# Altium schematic sheet SoftCore_SA_P3.SchDoc: =ProjectTitle
size B; Engineer: Hab S Collector; Address1: 3621 Gin Way; Address2: Snellville GA, 30039; SheetNumber: 3; SheetTotal: 7
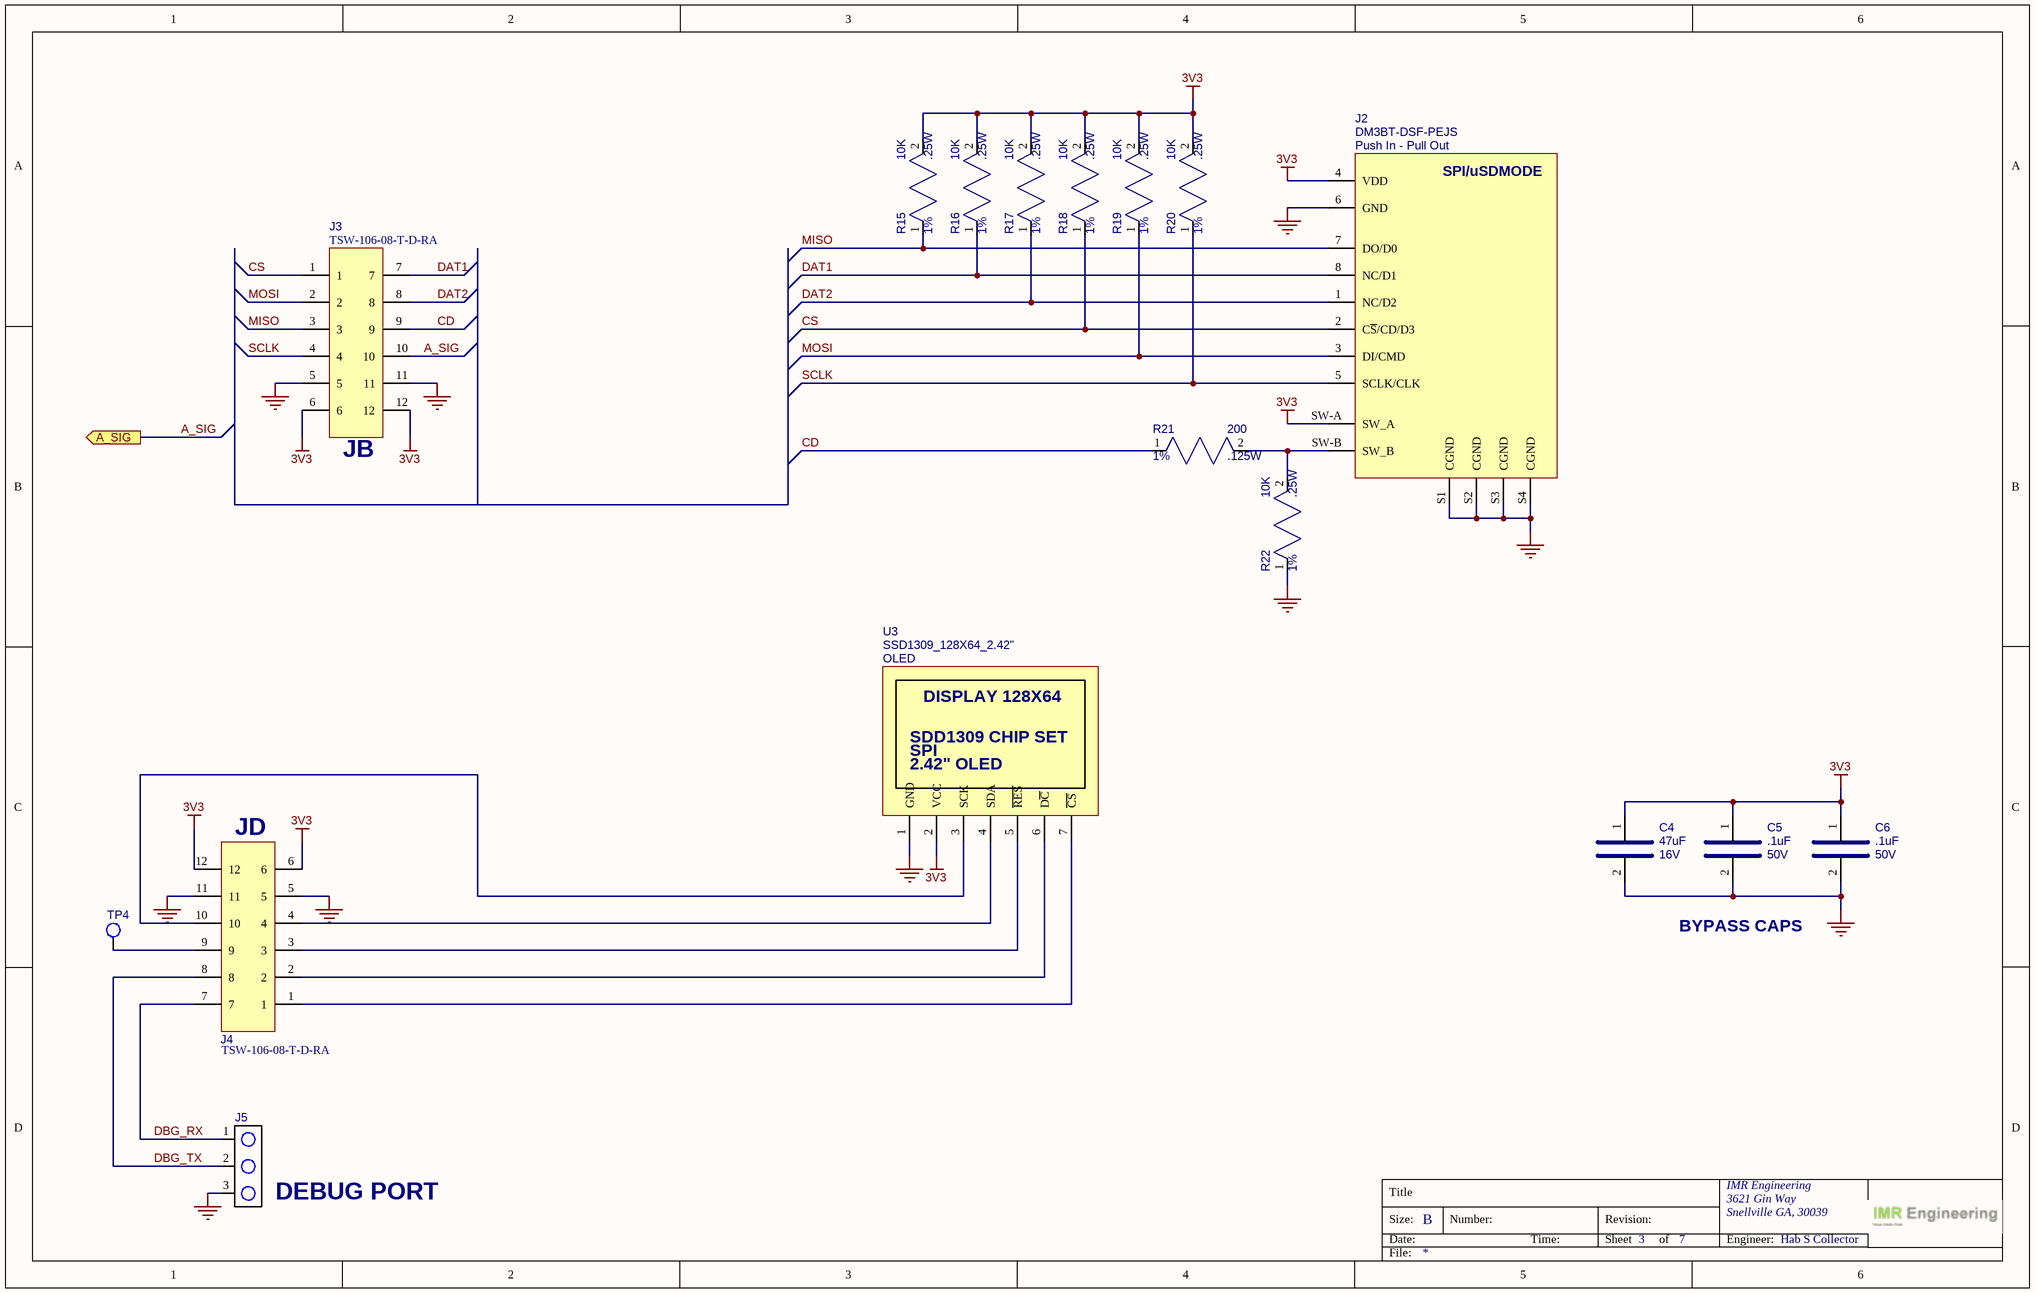
[diagram p0: SoftCore_SA_P3.SchDoc]

## Parts
C4  value 47uF  Voltage: 16V  [CAP_1210]  (hidden comment: GRM32ER60J476ME20L)
C5  value .1uF  Voltage: 50V  [CAP_0805]  (hidden comment: KGM21NR71H104KT)
C6  value .1uF  Voltage: 50V  [CAP_0805]  (hidden comment: KGM21NR71H104KT)
J2  value Push In - Pull Out  [HRS_DM3BT-DSF-PEJS]  (hidden comment: DM3BT-DSF-PEJS)
J3  TSW-106-08-T-D-RA  [SAMTEC_TSW-106-08-T-D-RA]
J4  TSW-106-08-T-D-RA  [SAMTEC_TSW-106-08-T-D-RA]
J5  PREC003SFAN-RC  [HDR_1X3_100MILL]  (value not drawn)
R15  value 10K  Power: .25W  Tolerance: 1%  [RES_0805]  (hidden comment: RC0805FR-7W10KL)
R16  value 10K  Power: .25W  Tolerance: 1%  [RES_0805]  (hidden comment: RC0805FR-7W10KL)
R17  value 10K  Power: .25W  Tolerance: 1%  [RES_0805]  (hidden comment: RC0805FR-7W10KL)
R18  value 10K  Power: .25W  Tolerance: 1%  [RES_0805]  (hidden comment: RC0805FR-7W10KL)
R19  value 10K  Power: .25W  Tolerance: 1%  [RES_0805]  (hidden comment: RC0805FR-7W10KL)
R20  value 10K  Power: .25W  Tolerance: 1%  [RES_0805]  (hidden comment: RC0805FR-7W10KL)
R21  value 200  Power: .125W  Tolerance: 1%  [RES_0805]  (hidden comment: RC0805FR-07200RL)
R22  value 10K  Power: .25W  Tolerance: 1%  [RES_0805]  (hidden comment: RC0805FR-7W10KL)
TP4  (no value)  [TEST_POINT_20MIL_TH]  (no BOM)
U3  TYPE: OLED  [MODULE_DISPLAY_128X64_2.42]  (hidden comment: SSD1309_128X64_2.42")

## Ports
A_SIG (out)

## Nets
3V3: C4.1 C5.1 C6.1 J2.4(VDD) J2.SW-A(SW_A) J3.6 J3.12 J4.6 J4.12 R15.2 R16.2 R17.2 R18.2 R19.2 R20.2 U3.2(VCC)
GND: C4.2 C5.2 C6.2 J2.6(GND) J2.S1(CGND) J2.S2(CGND) J2.S3(CGND) J2.S4(CGND) J3.5 J3.11 J4.5 J4.11 J5.3 R22.1 U3.1(GND)
A_SIG: J3.10 ; port A_SIG
CD: J3.9 R21.1
CS: J2.2(C~{S}/CD/D3) J3.1 R18.1
DAT1: J2.8(NC/D1) J3.7 R16.1
DAT2: J2.1(NC/D2) J3.8 R17.1
DBG_RX: J4.7 J5.1
DBG_TX: J4.8 J5.2
MISO: J2.7(DO/D0) J3.3 R15.1
MOSI: J2.3(DI/CMD) J3.2 R19.1
SCLK: J2.5(SCLK/CLK) J3.4 R20.1
NetJ2_SW-B: J2.SW-B(SW_B) R21.2 R22.2
NetJ4_1: J4.1 U3.7(~{CS})
NetJ4_2: J4.2 U3.6(D~{C})
NetJ4_3: J4.3 U3.5(~{RES})
NetJ4_4: J4.4 U3.4(SDA)
NetJ4_9: J4.9 TP4.1
NetJ4_10: J4.10 U3.3(SCK)

## Notes on the sheet
- (near J3) JB
- (near J4) JD
- BYPASS CAPS
- (near J5) DEBUG PORT
- Title
- Size:
- Date:
- B
- Number:
- Time:
- Revision:
- Sheet
- of
- IMR Engineering
- Engineer:
- File:
- (in symbol CONN_MICRO-SD_DM3BT-DSF-PEJS) SPI/uSDMODE
- (in symbol MODULE_DISPLAY_128X64_2.42) DISPLAY 128X64; SDD1309 CHIP SET; SPI; 2.42" OLED

## Library data of the parts
C4 = CAP_SMD_47UF_16V_1210: CAP CER 47UF 50V X5R 1210; MFG: Murata Electronics; Case/Package: 1210; MFG_PN: GRM32ER60J476ME20L; Supplier 1: DigiKey; Supplier Part Number 1: 490-1887-1-ND; Unit Price: .28
C5 C6 = CAP_SMD_0.1UF_50V_0805: CAP CER 0.1UF 50V X7R 0805; MFG: KYOCERA AVX; Case/Package: 0805; MFG_PN: KGM21NR71H104KT; Supplier 1: DigiKey; Supplier Part Number 1: 478-KGM21NR71H104KTCT-ND; Unit Price: .1
J2 = CONN_MICRO-SD_DM3BT-DSF-PEJS: CONN MICRO SD CARD R/A SMD; MFG: Hirose Electric Co Ltd; Case/Package: DM3BT-DSF-PEJS; Supplier 1: DigiKey; Supplier Part Number 1: HR1942CT-ND; Unit Price: 2.30; MFG_PN: DM3BT-DSF-PEJS
J3 J4 = CONN_HEADER_12P_100MIL_RA: CONN HEADER R/A 12POS 2.54MM; MFG: Samtec Inc.; Case/Package: 2P_2.54MM; Supplier 1: Digi-Key; Supplier Part Number 1: SAM1049-06-ND; Unit Price: .93; MFG_PN: TSW-106-08-T-D-RA
J5 = CONN_HEADER_3P_100MIL_VERT: CONN HEADER VERT 3POS 2.54MM; MFG: Sullins Connector Solutions; Case/Package: 2P_2.54MM; MFG_PN: PREC003SFAN-RC; Supplier 1: Digi-Key; Supplier Part Number 1: S1212EC-03-ND; Value: *; Unit Price: .07
R15-R20 R22 = RES_SMD_10K_0805_1/4W_1%: RES SMD 10K OHM 1% 1/4W 0805; MFG: Yageo; Case/Package: 0805; MFG_PN: RC0805FR-7W10KL; Supplier 1: DigiKey; Supplier Part Number 1: 13-RC0805FR-7W10KLCT-ND; Unit Price: .10
R21 = RES_SMD_200_0805_1/8W_1%: RES SMD 200 OHM 1% 1/8W 0805; MFG: Yageo; Case/Package: 0805; MFG_PN: RC0805FR-07200RL; Supplier 1: DigiKey; Supplier Part Number 1: 311-200CRCT-ND; Unit Price: .1
TP4 = CONN_TEST_POINT_TH_PAD_20MIL: TEST POINT TH 20MIL HOLE
U3 = MODULE_DISPLAY_128X64_2.42: DISPLAY 128X64 SSD1309 2.42" OLED WHITE; MFG: UNKNOWN; NOTES: This display is sold by several companies on Amazon - you can identify it by description and the back of the PCB - sellers: HiLetgo, Aceirmc; Case/Package: MODULE_DISPLAY_128X64_2.42; Supplier 1: Amazon; Supplier Part Number 1: SSD1309 2.42"; Unit Price: 16.99; Resolution: 128X64; MFG_PN: SSD1309_128X64_2.42"